# Altium schematic sheet 48PinConnector.SchDoc
size A; SheetNumber: 3; SheetTotal: 3
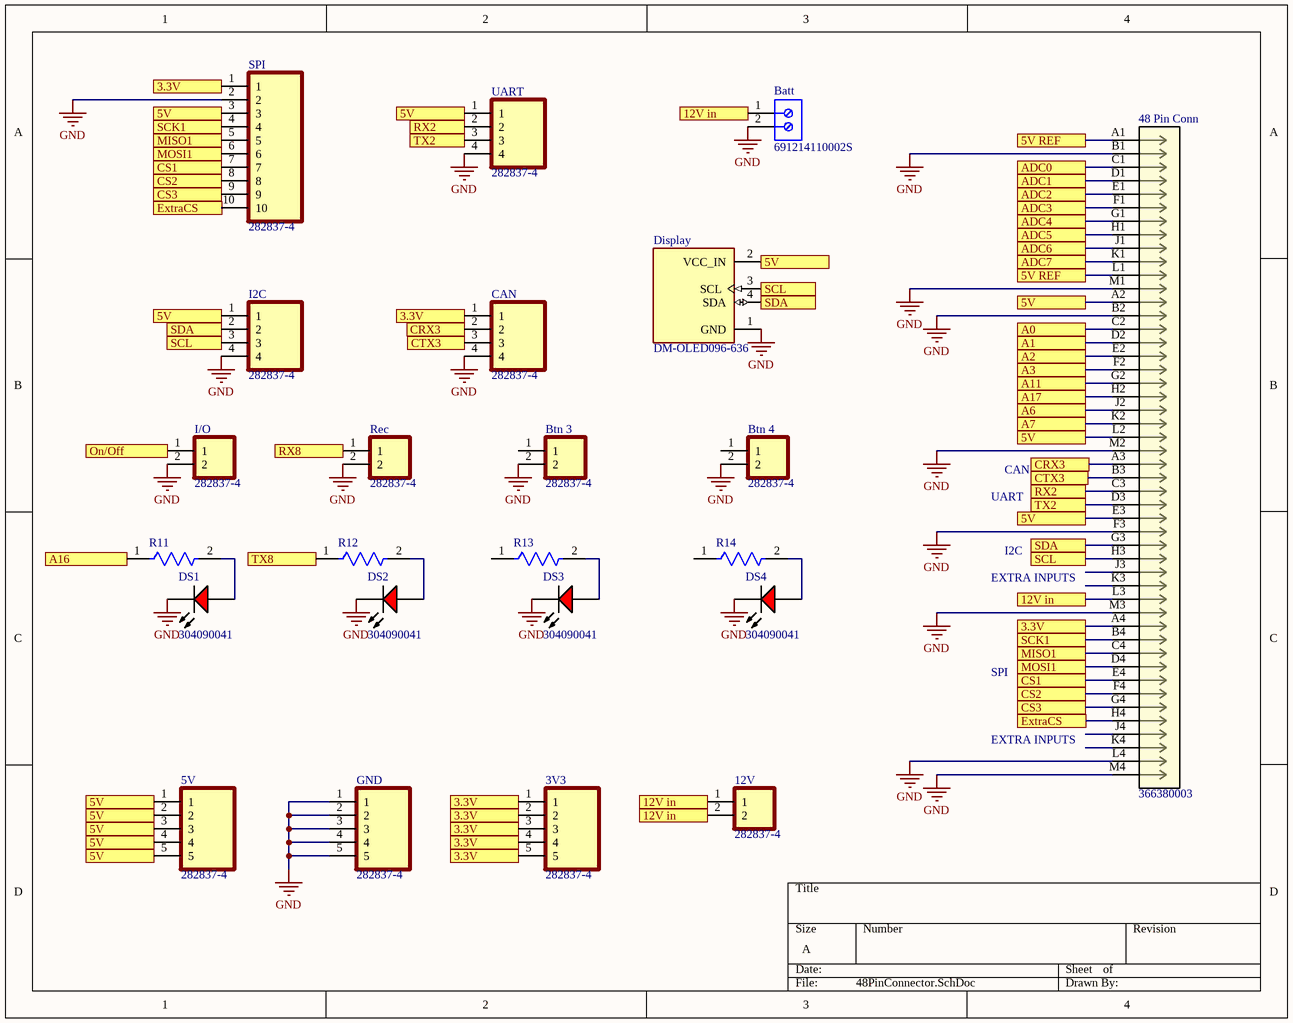
[diagram p0: 48PinConnector.SchDoc]

## Parts
3V3  282837-4  [TE_282837-4]
5V  282837-4  [TE_282837-4]
12V  282837-4  [TE_282837-4]
48_Pin_Conn  366380003  [CONN_36638-0003_MOL]
Batt  691214110002S  [691214110002S]
Btn_3  282837-4  [TE_282837-4]
Btn_4  282837-4  [TE_282837-4]
CAN  282837-4  [TE_282837-4]
Display  DM-OLED096-636  [MODULE_DM-OLED096-636]
DS1  304090041  [LED-2P-2.28-3MM_A]
DS2  304090041  [LED-2P-2.28-3MM_A]
DS3  304090041  [LED-2P-2.28-3MM_A]
DS4  304090041  [LED-2P-2.28-3MM_A]
GND  282837-4  [TE_282837-4]
I2C  282837-4  [TE_282837-4]
I/O  282837-4  [TE_282837-4]
R11  RT0603BRD07300RL  [FP-RT0603-MFG]  (value not drawn)
R12  RT0603BRD07300RL  [FP-RT0603-MFG]  (value not drawn)
R13  RT0603BRD07300RL  [FP-RT0603-MFG]  (value not drawn)
R14  RT0603BRD07300RL  [FP-RT0603-MFG]  (value not drawn)
Rec  282837-4  [TE_282837-4]
SPI  282837-4  [TE_282837-4]
UART  282837-4  [TE_282837-4]

## Ports
3.3V (see 48PinConnector[1A], 48PinConnector[2B], 48PinConnector[2D], 48PinConnector[4C], MainSchematic.3[1C], MainSchematic.3[1D], MainSchematic.3[2A], MainSchematic.3[5A], MainSchematic.3[5B], MainSchematic.3[5C]), 3.3V (see 48PinConnector[1A], 48PinConnector[2B], 48PinConnector[2D], MainSchematic.3[1C], MainSchematic.3[1D], MainSchematic.3[2A], MainSchematic.3[5A], MainSchematic.3[5B], MainSchematic.3[5C]), 3.3V (see 48PinConnector[1A], 48PinConnector[2D], 48PinConnector[4C], MainSchematic.3[1C], MainSchematic.3[1D], MainSchematic.3[2A], MainSchematic.3[5A], MainSchematic.3[5B], MainSchematic.3[5C]), 3.3V (see 48PinConnector[2B], 48PinConnector[2D], 48PinConnector[4C], MainSchematic.3[1C], MainSchematic.3[1D], MainSchematic.3[2A], MainSchematic.3[5A], MainSchematic.3[5B], MainSchematic.3[5C]), 5V (see 48PinConnector[1A], 48PinConnector[1B], 48PinConnector[1D], 48PinConnector[2A], 48PinConnector[3B], 48PinConnector[4B], 48PinConnector[4C], MainSchematic.3[1C], MainSchematic.3[2B], MainSchematic.3[5A], MainSchematic.3[6B]), 5V (see 48PinConnector[1A], 48PinConnector[1B], 48PinConnector[1D], 48PinConnector[2A], 48PinConnector[3B], 48PinConnector[4B], MainSchematic.3[1C], MainSchematic.3[2B], MainSchematic.3[5A], MainSchematic.3[6B]), 5V (see 48PinConnector[1A], 48PinConnector[1B], 48PinConnector[1D], 48PinConnector[2A], 48PinConnector[4B], 48PinConnector[4C], MainSchematic.3[1C], MainSchematic.3[2B], MainSchematic.3[5A], MainSchematic.3[6B]), 5V (see 48PinConnector[1A], 48PinConnector[1B], 48PinConnector[1D], 48PinConnector[3B], 48PinConnector[4B], 48PinConnector[4C], MainSchematic.3[1C], MainSchematic.3[2B], MainSchematic.3[5A], MainSchematic.3[6B]), 5V (see 48PinConnector[1A], 48PinConnector[1D], 48PinConnector[2A], 48PinConnector[3B], 48PinConnector[4B], 48PinConnector[4C], MainSchematic.3[1C], MainSchematic.3[2B], MainSchematic.3[5A], MainSchematic.3[6B]), 5V (see 48PinConnector[1B], 48PinConnector[1D], 48PinConnector[2A], 48PinConnector[3B], 48PinConnector[4B], 48PinConnector[4C], MainSchematic.3[1C], MainSchematic.3[2B], MainSchematic.3[5A], MainSchematic.3[6B]), 5V REF (see 48PinConnector[4A], MainSchematic.3[3C], MainSchematic.3[6C]), 5V REF (see 48PinConnector[4B], MainSchematic.3[3C], MainSchematic.3[6C]), 12V in (see 48PinConnector[2D], 48PinConnector[3A], 48PinConnector[4C], MainSchematic.3[5B], MainSchematic.3[5C]), 12V in (see 48PinConnector[2D], 48PinConnector[3A], MainSchematic.3[5B], MainSchematic.3[5C]), 12V in (see 48PinConnector[2D], 48PinConnector[4C], MainSchematic.3[5B], MainSchematic.3[5C]), A0 (see MainSchematic.3[1A], MainSchematic.3[5A]), A1 (see MainSchematic.3[1A], MainSchematic.3[5A]), A2 (see MainSchematic.3[1B], MainSchematic.3[5A]), A3 (see MainSchematic.3[1B], MainSchematic.3[5A]), A6 (see MainSchematic.3[1B], MainSchematic.3[5A]), A7 (see MainSchematic.3[1B], MainSchematic.3[5A]), A11 (see MainSchematic.3[1B], MainSchematic.3[5B]), A16 (see MainSchematic.3[2A], MainSchematic.3[5B]), A17 (see MainSchematic.3[2A], MainSchematic.3[5B]), ADC0 (see Filters.3[1A], MainSchematic.3[2B]), ADC1 (see Filters.3[1A], MainSchematic.3[2C]), ADC2 (see Filters.3[1B], MainSchematic.3[2C]), ADC3 (see Filters.3[1B], MainSchematic.3[2C]), ADC4 (see Filters.3[2A], MainSchematic.3[2C]), ADC5 (see Filters.3[2A], MainSchematic.3[2C]), ADC6 (see Filters.3[2B], MainSchematic.3[2C]), ADC7 (see Filters.3[2B], MainSchematic.3[2C]), CRX3 (see 48PinConnector[2B], MainSchematic.3[1B], MainSchematic.3[5B]), CRX3 (see 48PinConnector[4B], MainSchematic.3[1B], MainSchematic.3[5B]), CS1 (see 48PinConnector[1A], MainSchematic.3[2B], MainSchematic.3[5A]), CS1 (see 48PinConnector[4C], MainSchematic.3[2B], MainSchematic.3[5A]), CS2 (see 48PinConnector[1A], MainSchematic.3[2A], MainSchematic.3[5B]), CS2 (see 48PinConnector[4C], MainSchematic.3[2A], MainSchematic.3[5B]), CS3 (see 48PinConnector[1A], MainSchematic.3[2A], MainSchematic.3[5B]), CS3 (see 48PinConnector[4C], MainSchematic.3[2A], MainSchematic.3[5B]), CTX3 (see 48PinConnector[2B], MainSchematic.3[2A], MainSchematic.3[5B]), CTX3 (see 48PinConnector[4B], MainSchematic.3[2A], MainSchematic.3[5B]), ExtraCS (see 48PinConnector[1A], MainSchematic.3[2A], MainSchematic.3[5B]), ExtraCS (see 48PinConnector[4C], MainSchematic.3[2A], MainSchematic.3[5B]), MISO1 (see 48PinConnector[1A], MainSchematic.3[1A], MainSchematic.3[5A]), MISO1 (see 48PinConnector[4C], MainSchematic.3[1A], MainSchematic.3[5A]), MOSI1 (see 48PinConnector[1A], MainSchematic.3[1B], MainSchematic.3[5B]), MOSI1 (see 48PinConnector[4C], MainSchematic.3[1B], MainSchematic.3[5B]), On/Off (see MainSchematic.3[2B]), RX2 (see 48PinConnector[2A], MainSchematic.3[1A], MainSchematic.3[4D], MainSchematic.3[5A]), RX2 (see 48PinConnector[4B], MainSchematic.3[1A], MainSchematic.3[4D], MainSchematic.3[5A]), RX8 (see MainSchematic.3[2A], MainSchematic.3[5B]), SCK1 (see 48PinConnector[1A], MainSchematic.3[1B], MainSchematic.3[5B]), SCK1 (see 48PinConnector[4C], MainSchematic.3[1B], MainSchematic.3[5B]), SCL (see 48PinConnector[1B], 48PinConnector[3B], MainSchematic.3[1B], MainSchematic.3[5A]), SCL (see 48PinConnector[1B], 48PinConnector[4C], MainSchematic.3[1B], MainSchematic.3[5A]), SCL (see 48PinConnector[3B], 48PinConnector[4C], MainSchematic.3[1B], MainSchematic.3[5A]), SDA (see 48PinConnector[1B], 48PinConnector[3B], MainSchematic.3[1B], MainSchematic.3[5A]), SDA (see 48PinConnector[1B], 48PinConnector[4C], MainSchematic.3[1B], MainSchematic.3[5A]), SDA (see 48PinConnector[3B], 48PinConnector[4C], MainSchematic.3[1B], MainSchematic.3[5A]), TX2 (see 48PinConnector[2A], MainSchematic.3[1A], MainSchematic.3[4D], MainSchematic.3[5A]), TX2 (see 48PinConnector[4B], MainSchematic.3[1A], MainSchematic.3[4D], MainSchematic.3[5A]), TX8 (see MainSchematic.3[2A], MainSchematic.3[5B])

## Nets
GND: 48_Pin_Conn.B1 48_Pin_Conn.B2 48_Pin_Conn.F3 48_Pin_Conn.L4 48_Pin_Conn.M1 48_Pin_Conn.M2 48_Pin_Conn.M3 48_Pin_Conn.M4 Batt.2 Btn_3.2 Btn_4.2 CAN.4 Display.1(GND) DS1.2(K) DS2.2(K) DS3.2(K) DS4.2(K) GND.1 GND.2 GND.3 GND.4 GND.5 I2C.4 I/O.2 Rec.2 SPI.2 UART.4
3.3V: 3V3.1 3V3.2 3V3.3 3V3.4 3V3.5 48_Pin_Conn.A4 CAN.1 SPI.1 ; port 3.3V
5V: 5V.1 5V.2 5V.3 5V.4 5V.5 48_Pin_Conn.A2 48_Pin_Conn.E3 48_Pin_Conn.L2 Display.2(VCC_IN) I2C.1 SPI.3 UART.1 ; port 5V
5V REF: 48_Pin_Conn.A1 48_Pin_Conn.L1 ; port 5V REF
12V in: 12V.1 12V.2 48_Pin_Conn.L3 Batt.1 ; port 12V in
A0: 48_Pin_Conn.C2 ; port A0
A1: 48_Pin_Conn.D2 ; port A1
A2: 48_Pin_Conn.E2 ; port A2
A3: 48_Pin_Conn.F2 ; port A3
A6: 48_Pin_Conn.J2 ; port A6
A7: 48_Pin_Conn.K2 ; port A7
A11: 48_Pin_Conn.G2 ; port A11
A16: R11.1 ; port A16
A17: 48_Pin_Conn.H2 ; port A17
ADC0: 48_Pin_Conn.C1 ; port ADC0
ADC1: 48_Pin_Conn.D1 ; port ADC1
ADC2: 48_Pin_Conn.E1 ; port ADC2
ADC3: 48_Pin_Conn.F1 ; port ADC3
ADC4: 48_Pin_Conn.G1 ; port ADC4
ADC5: 48_Pin_Conn.H1 ; port ADC5
ADC6: 48_Pin_Conn.J1 ; port ADC6
ADC7: 48_Pin_Conn.K1 ; port ADC7
CRX3: 48_Pin_Conn.A3 CAN.2 ; port CRX3
CS1: 48_Pin_Conn.E4 SPI.7 ; port CS1
CS2: 48_Pin_Conn.F4 SPI.8 ; port CS2
CS3: 48_Pin_Conn.G4 SPI.9 ; port CS3
CTX3: 48_Pin_Conn.B3 CAN.3 ; port CTX3
ExtraCS: 48_Pin_Conn.H4 SPI.10 ; port ExtraCS
MISO1: 48_Pin_Conn.C4 SPI.5 ; port MISO1
MOSI1: 48_Pin_Conn.D4 SPI.6 ; port MOSI1
On/Off: I/O.1 ; port On/Off
RX2: 48_Pin_Conn.C3 UART.2 ; port RX2
RX8: Rec.1 ; port RX8
SCK1: 48_Pin_Conn.B4 SPI.4 ; port SCK1
SCL: 48_Pin_Conn.H3 Display.3(SCL) I2C.3 ; port SCL
SDA: 48_Pin_Conn.G3 Display.4(SDA) I2C.2 ; port SDA
TX2: 48_Pin_Conn.D3 UART.3 ; port TX2
TX8: R12.1 ; port TX8
NetDS1_1: DS1.1(A) R11.2
NetDS2_1: DS2.1(A) R12.2
NetDS3_1: DS3.1(A) R13.2
NetDS4_1: DS4.1(A) R14.2

Not connected (* = marked no-connect by the designer): 48_Pin_Conn J3 J4 K3 K4; Btn_3 1; Btn_4 1; R13 1; R14 1

## Notes on the sheet
- UART
- CAN
- I2C
- EXTRA INPUTS
- SPI

## Library data of the parts
3V3 5V 12V Btn_3 Btn_4 CAN GND I2C I/O Rec SPI UART = 282837-4: 4 Position Wire to Board Terminal Block Horizontal with Board 0.200 (5.08mm) Through Hole; MF: TE Connectivity; Value: *; SnapEDA_Link: https://www.snapeda.com/parts/282837-4/TE+Connectivity+AMP+Connectors/view-part/?ref=snap; Purchase-URL: https://pricing.snapeda.com/search/part/282837-4/?ref=eda; EU_RoHS_Compliance: Compliant with Exemptions; Availability: In Stock; Price: None; Package: None; Check_prices: https://www.snapeda.com/parts/282837-4/TE+Connectivity+AMP+Connectors/view-part/?ref=eda; MP: 282837-4
48_Pin_Conn = 366380003: 2.50mm, 3.50mm CMC Header, Right-Angle, 48 Position, 1 Port, Brown, Peg,  Lead-Free; Manufacturer_Name: Molex Connector Corporation; Copyright: Copyright (C) 2025 Ultra Librarian. All rights reserved.; Manufacturer_Part_Number: 366380003; RefDes: RefDes; Type: Type
Batt = CMP-1502-02465-2: NexarPartId: 94172715; Voltage Rating: 300V; Number of Contacts: 2; Current Rating: 10A; Lead Pitch: 3.5mm; Height: 9.2mm; Min Operating Temperature: -30°C; Number of Pins: 2; Packaging: Box; Max Operating Temperature: 120°C; Contact Material: Nickel, Tin; Number of Rows: 1
Display = DM-OLED096-636: 0.96â€ 128 X 64 MONOCHROME GRAPHIC OLED DISPLAY MODULE - I2C; SnapEDA_Link: https://www.snapeda.com/parts/DM-OLED096-636/Display+Module/view-part/?ref=snap; Package: Package; Value: *; MF: Display Module; MP: DM-OLED096-636; Check_prices: https://www.snapeda.com/parts/DM-OLED096-636/Display+Module/view-part/?ref=eda
DS1-DS4 = CMP-007-00007-2: Red LED, 80 mW, 30 mA, -25 to 85 degC, 2-Pin THD; Manufacturer: Shenzhen CGX; Package Description: 2-Pin Through Hole Device, Dia 3 mm, Pitch 2.28 mm; Datasheet URL: http://datasheet.octopart.com/304090041-Chengguangxing-datasheet-62330656.pdf; Mounting Technology: TH; Manufacturer URL: http://szcgx.com/; RoHS Compliant: Unknown; Datasheet Version: Sep-14; Case/Package: 304090041; Package Reference: 304090041
R11-R14 = CMP-2000-04432-2: RES SMD 300 OHM 0.1% 1/10W 0603; Manufacturer: Yageo; Voltage Rating: 75V; Temperature Coefficient: 25 ppm/°C; Tolerance: 0.001; Value: 300Ω; Power Rating: 0.1W; Description: RT0603 300Ω 0.1W 25 ppm/°C 0.10%; Category: Res; Temperature Range High: +155°C; Composition: Thin Film; Lead Free: Yes; Height: 0.55mm; RoHS: TRUE; Temperature Range Low: -55°C; Octopart: https://octopart.com/rt0603brd07300rl-yageo-1463297; Mouser Description: Thin Film Resistors - SMD 1/10W 300 ohm .1% 25ppm; Series: RT; Package: RT0603; Digikey Description: RES SMD 300 OHM 0.1% 1/10W 0603; Device Class L3: Chip SMD Resistors; ComponentLink2URL: http://www.yageo.com/documents/recent/PYu-RT_1-to-0.01_RoHS_L_9.pdf; Manufacturer Part Number: RT0603BRD07300RL; Device Class L1: Passive Components; Automotive: No; Footprint Url: http://www.yageo.com/exep/pages/download/literatures/PYu-R_Mount_10.pdf; Device Class L2: Resistors; Temperature: -55°C to +155°C; ComponentLink2Description: Datasheet; Ipc Land Pattern Name: RESC16080X45; Resistance: 300Ω